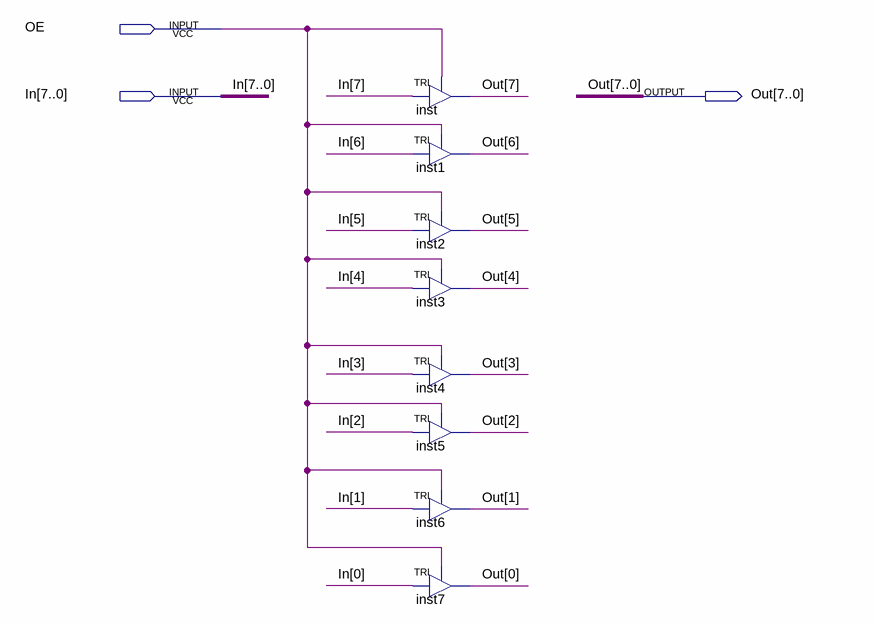
[diagram p0: schematic sheet]
// Quartus schematic Tri_8bit.bdf as structural Verilog: 8 symbols, 3 pins
module Tri_8bit (
  input  OE,
  input  [7:0] In,
  output [7:0] Out
);

  TRI inst (.IN(In[7]), .OE(OE), .OUT(Out[7]));
  TRI inst1 (.IN(In[6]), .OE(OE), .OUT(Out[6]));
  TRI inst2 (.IN(In[5]), .OE(OE), .OUT(Out[5]));
  TRI inst3 (.IN(In[4]), .OE(OE), .OUT(Out[4]));
  TRI inst4 (.IN(In[3]), .OE(OE), .OUT(Out[3]));
  TRI inst5 (.IN(In[2]), .OE(OE), .OUT(Out[2]));
  TRI inst6 (.IN(In[1]), .OE(OE), .OUT(Out[1]));
  TRI inst7 (.IN(In[0]), .OE(OE), .OUT(Out[0]));
endmodule
